# EAGLE design wheelBLE (EAGLE 8.1.0)
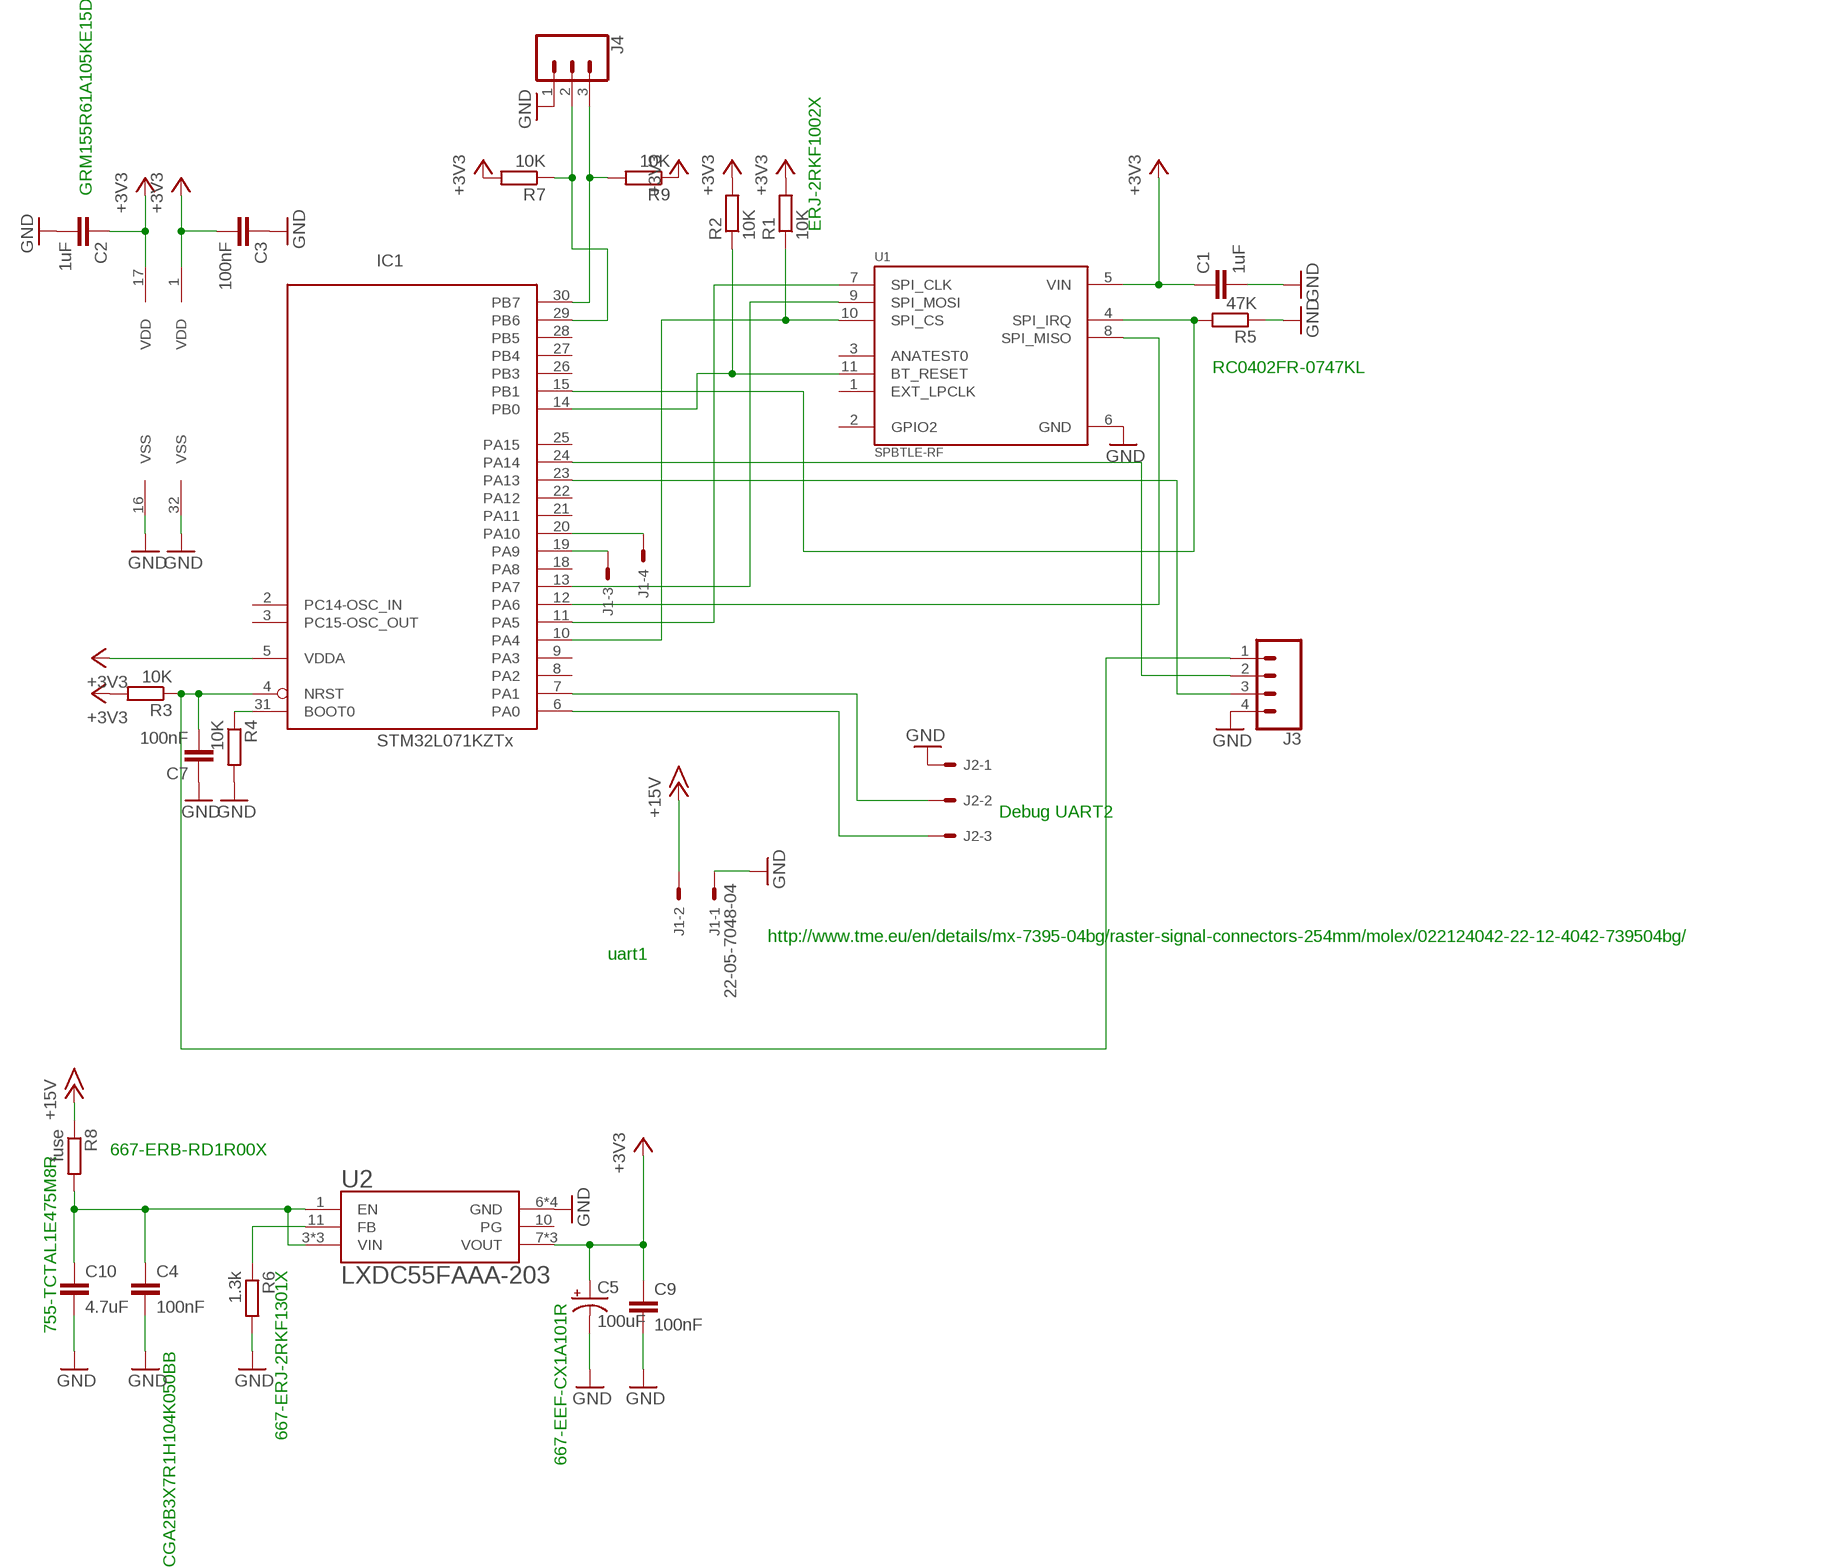
[diagram p0: schematic, sheet 1]

## Parts
C1  1uF  C-EUC0402  [C0402]
C2  1uF  C-EUC0402  [C0402]
C3  100nF  C-EUC0402  [C0402]
C4  100nF  C-EUC0402  [C0402]
C5  100uF  100UF-POLAR-EIA7343-10V-10%(TANT)  [EIA7343]
C7  100nF  C-EUC0402  [C0402]
C9  100nF  C-EUC0402  [C0402]
C10  4.7uF  4.7UF-1206-16V-(+80/-20%)  [1206]
IC1  STM32L071KZTx  STM32L051K8T  [LQFP32]
J1  22-05-7048-04  [7395-04]
J2  22-05-7038-03  [7395-03]
J3  CONN_04  [1X04]
J4  CONN_03SMD  [1X03-1MM-RA]
R1  10K  R-EU_R0402  [R0402]
R2  10K  R-EU_R0402  [R0402]
R3  10K  R-EU_R0402  [R0402]
R4  10K  R-EU_R0402  [R0402]
R5  47K  R-EU_R0402  [R0402]
R6  1.3k  R-EU_R0402  [R0402]
R7  10K  R-EU_R0402  [R0402]
R8  fuse  R-EU_R0402  [R0402]
R9  10K  R-EU_R0402  [R0402]
U1  SPBTLE-RF  [XCVR_SPBTLE-RF]
U2  LXDC55FAAA-203  [CONV_LXDC55FAAA-203]

## Nets
+3V3: C1.1 C2.1 C3.2 C5.A(+) C9.1 IC1.1(VDD) IC1.5(VDDA) IC1.17(VDD) R1.2 R2.2 R3.2 R7.2 R9.1 U1.5(VIN) U2.7(VOUT) U2.8(VOUT) U2.9(VOUT)
+15V: J1.2 R8.1
GND: C1.2 C2.2 C3.1 C4.2 C5.C(-) C7.1 C9.2 C10.2 IC1.16(VSS) IC1.32(VSS) J1.1 J2.1 J3.4 J4.1 R4.2 R5.1 R6.2 U1.6(GND) U2.6(GND) U2.12(GND) U2.13(GND) U2.14(GND)
N$1: IC1.10(PA4) R1.1 U1.10(SPI_CS)
N$2: IC1.14(PB0) R2.1 U1.11(BT_RESET)
N$3: C7.2 IC1.4(NRST) J3.1 R3.1
N$4: IC1.31(BOOT0) R4.1
N$5: IC1.11(PA5) U1.7(SPI_CLK)
N$6: IC1.12(PA6) U1.8(SPI_MISO)
N$7: IC1.13(PA7) U1.9(SPI_MOSI)
N$8: IC1.6(PA0) J2.3
N$9: IC1.19(PA9) J1.3
N$10: IC1.20(PA10) J1.4
N$11: IC1.15(PB1) R5.2 U1.4(SPI_IRQ)
N$12: IC1.7(PA1) J2.2
N$13: R6.1 U2.11(FB)
N$14: C4.1 C10.1 R8.2 U2.1(EN) U2.3(VIN) U2.4(VIN) U2.5(VIN)
N$15: IC1.23(PA13) J3.3
N$16: IC1.24(PA14) J3.2
N$17: IC1.30(PB7) J4.3 R9.2
N$18: IC1.29(PB6) J4.2 R7.1
Unconnected: IC1.2(PC14-OSC_IN) IC1.3(PC15-OSC_OUT) IC1.8(PA2) IC1.9(PA3) IC1.18(PA8) IC1.21(PA11) IC1.22(PA12) IC1.25(PA15) IC1.26(PB3) IC1.27(PB4) IC1.28(PB5) U1.1(EXT_LPCLK) U1.2(GPIO2) U1.3(ANATEST0) U2.10(PG)

## Notes on the sheet
- GRM155R61A105KE15D
- ERJ-2RKF1002X
- RC0402FR-0747KL
- Debug UART2
- http://www.tme.eu/en/details/mx-7395-04bg/raster-signal-connectors-254mm/molex/022124042-22-12-4042-739504bg/
- uart1
- 667-ERB-RD1R00X
- 667-EEF-CX1A101R
- 755-TCTAL1E475M8R
- CGA2B3X7R1H104K050BB
- 667-ERJ-2RKF1301X

## Library data of the parts
C1-C4 C7 C9 = rcl:C-EU: CAPACITOR, European symbol
C5 = SparkFun-Capacitors:100UF-POLAR: 100µF polarized capacitors A capacitor is a passive two-terminal electrical component used to store electrical energy temporarily in an electric field.; PROD_ID: CAP-07890
C10 = SparkFun-Capacitors:4.7UF: 4.7µF ceramic capacitors A capacitor is a passive two-terminal electrical component used to store electrical energy temporarily in an electric field.; PROD_ID: CAP-10300
IC1 = micro-stm_v2:STM32L051K*T: ARM 32-bit Cortex™-M0+ CPU 32 MHz maximum frequency 32 to 64 Kbytes of Flash memory 2 kbyte of Data EEPROM 8 kbytes of SRAM 27 GPIOs 1.8 to 3.6 V application supply
J1 = EP_molex_6410_7395:22-?-04: CONNECTOR wire to board 2.54 mm (.1 inch) pitch header
J2 = ep_molex_6410_7395-02:22-?-03: CONNECTOR wire to board 2.54 mm (.1 inch) pitch header
J3 = SparkFun-Connectors:CONN_04: Multi connection point. Often used as Generic Header-pin footprint for 0.1 inch spaced/style header connections On any of the 0.1 inch spaced packages, you can populate with these: Break Away Headers - Straight <https://www.sparkfun.com/products/116> (PRT-00116) Break Away Male Headers - Right Angle <https://www.sparkfun.com/products/553> (PRT-00553) Female Headers <https://www.sparkfun.com/products/115> (PRT-00115) Break Away Headers - Machine Pin <https://www.sparkfun.com/products/117> (PRT-00117) Break Away Female Headers - Swiss Machine Pin <https://www.sparkfun.com/products/743> (PRT-00743) For SCREWTERMINALS and SPRING TERMINALS visit here: Screw Terimnals on SparkFun.com <https://www.sparkfun.com/search/results?term=Screw+Terminals> (5mm/3.5mm/2.54mm spacing) This device is also useful as a general connection point to wire up your design to another part of your project. Our various solder wires solder well into these plated through hole pads. Hook-Up Wire - Assortment (Stranded, 22 AWG) <https://www.sparkfun.com/products/11375> (PRT-11375) Hook-Up Wire - Assortment (Solid Core, 22 AWG) <https://www.sparkfun.com/products/11367> (PRT-11367) View the entire wire category on our website here <https://www.sparkfun.com/categories/141> Special notes: Molex polarized connector foot print use with SKU : PRT-08231 with associated crimp pins and housings. 1MM SMD Version SKU: PRT-10208; PROD_ID: CONN-09696
J4 = SparkFun-Connectors:CONN_03: Multi connection point. Often used as Generic Header-pin footprint for 0.1 inch spaced/style header connections On any of the 0.1 inch spaced packages, you can populate with these: Break Away Headers - Straight <https://www.sparkfun.com/products/116> (PRT-00116) Break Away Male Headers - Right Angle <https://www.sparkfun.com/products/553> (PRT-00553) Female Headers <https://www.sparkfun.com/products/115> (PRT-00115) Break Away Headers - Machine Pin <https://www.sparkfun.com/products/117> (PRT-00117) Break Away Female Headers - Swiss Machine Pin <https://www.sparkfun.com/products/743> (PRT-00743) Stackable Header - 3 Pin (Female, 0.1") <https://www.sparkfun.com/products/13875> (PRT-13875) For SCREWTERMINALS and SPRING TERMINALS visit here: Screw Terimnals on SparkFun.com <https://www.sparkfun.com/search/results?term=Screw+Terminals> (5mm/3.5mm/2.54mm spacing) This device is also useful as a general connection point to wire up your design to another part of your project. Our various solder wires solder well into these plated through hole pads. Hook-Up Wire - Assortment (Stranded, 22 AWG) <https://www.sparkfun.com/products/11375> (PRT-11375) Hook-Up Wire - Assortment (Solid Core, 22 AWG) <https://www.sparkfun.com/products/11367> (PRT-11367) View the entire wire category on our website here <https://www.sparkfun.com/categories/141> Special notes: Molex polarized connector foot print use with SKU : PRT-08232 with associated crimp pins and housings.
R1-R9 = rcl:R-EU_: RESISTOR, European symbol
U1 = SPBTLE-RF:SPBTLE-RF: Very low power module for Bluetooth Smart v4.1; AVAILABILITY: Good; DESCRIPTION: Very low power module for Bluetooth Smart v4.1; MF: STMicroelectronics; MP: SPBTLE-RF; PACKAGE: None; PRICE: 7.77 USD
U2 = LXDC55FAAA-203:LXDC55FAAA-203: Conv DC-DC Quad Step Down 4V to 14V 14-Pin SMD T/R; AVAILABILITY: Good; DESCRIPTION: Conv DC-DC Quad Step Down 4V to 14V 14-Pin SMD T/R; MF: Murata; MP: LXDC55FAAA-203; PACKAGE: SMD-14 Murata; PRICE: 3.06 USD

## Board
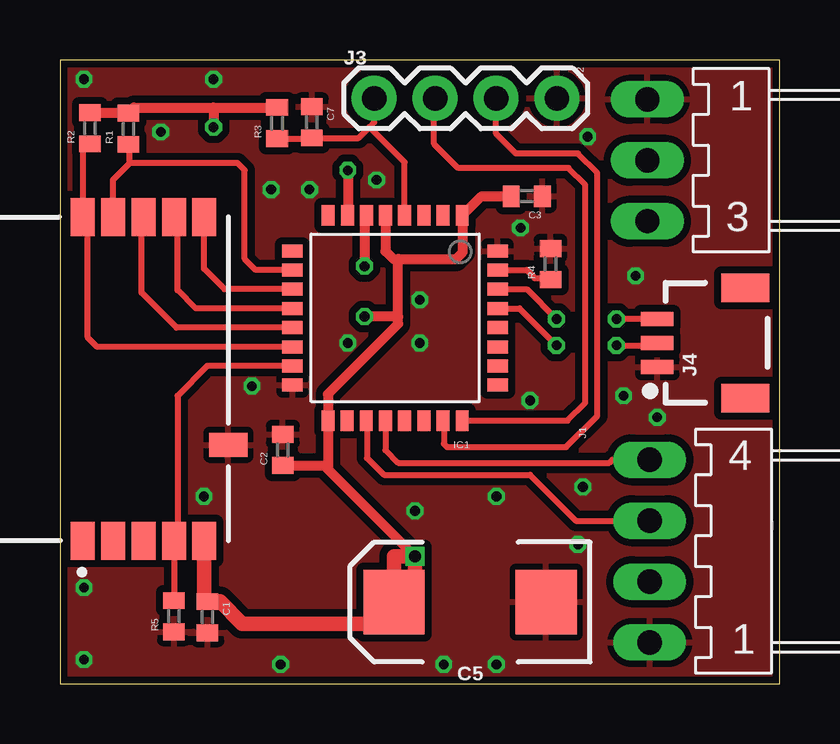
[diagram p1: board, top side]
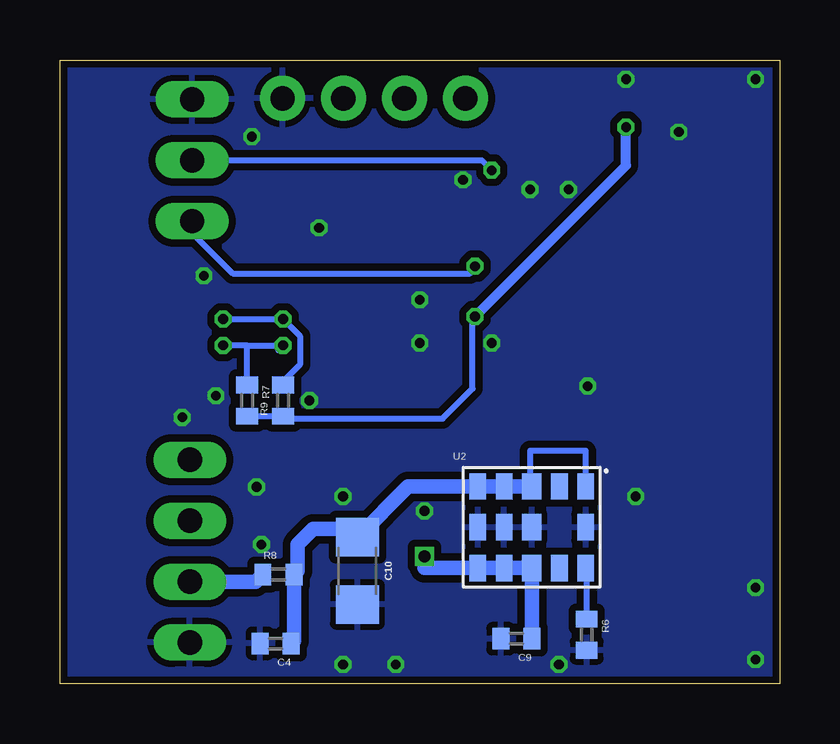
[diagram p2: board, bottom side, seen from below]

Size 30 x 26 mm. Coordinates in mm from the lower left corner, seen from the top.
Outline: 0,0 30,0 30,26 0,26 0,0
Copper layers (1*16): Top 0.035mm / dielectric 1.5mm / Bottom 0.035mm
Design rules "SeeedStudio_2layer_DRU_no_angle_20140221": minimum track width 6mil, minimum drill 12mil, track to track 6mil, track to pad 6mil, pad to pad 6mil, via to via 6mil, smd to smd 0mil, copper to edge 10mil, drill to drill 10mil, minimum pad ring 10mil, minimum via ring 6mil, stop-mask expansion 2mil, vias tented up to drill 100mil, thermal gap 10mil

### Footprints (pad centres in the part's own frame; a part is rotated, then mirrored left to right if it is on the bottom)
C0402 = smd 0.7 x 0.9: 1 -0.65,0; 2 0.65,0
EIA7343 = smd 2.55 x 2.7: A 3.17,0; C -3.17,0
1206 = smd 1.6 x 1.8: 1 -1.4,0; 2 1.4,0
LQFP32 = smd 0.54 x 0.85: 1 -2.8,-4.275; 2 -2,-4.275; 3 -1.2,-4.275; 4 -0.4,-4.275; 5 0.4,-4.275; 6 1.19,-4.275; 7 1.99,-4.275; 8 2.79,-4.275; 17 2.8,4.275; 18 2,4.275; 19 1.2,4.275; 20 0.4,4.275; 21 -0.4,4.275; 22 -1.2,4.275; 23 -2,4.275; 24 -2.8,4.275 | smd 0.85 x 0.54: 9 4.275,-2.8; 10 4.275,-2; 11 4.275,-1.2; 12 4.275,-0.4; 13 4.275,0.4; 14 4.275,1.2; 15 4.275,2; 16 4.275,2.8; 25 -4.275,2.8; 26 -4.275,2; 27 -4.275,1.2; 28 -4.275,0.4; 29 -4.275,-0.4; 30 -4.275,-1.2; 31 -4.275,-2; 32 -4.275,-2.8
7395-04 = drill 1.016 long: 1 3.81,0; 2 1.27,0; 3 -1.27,0; 4 -3.81,0
7395-03 = drill 1.016 long: 1 2.54,0; 2 0,0; 3 -2.54,0
1X04 = drill 1.016 pad 1.88: 1 0,0; 2 2.54,0; 3 5.08,0; 4 7.62,0
1X03-1MM-RA = smd 0.6 x 1.35: 1 -1,0; 2 0,0; 3 1,0 | smd 1.2 x 2: NC1 2.3,-3.675; NC2 -2.3,-3.675
R0402 = smd 0.7 x 0.9: 1 -0.65,0; 2 0.65,0
XCVR_SPBTLE-RF = smd 1.6 x 1: 1 -6.75,0.33; 2 -6.75,-0.94; 3 -6.75,-2.21; 4 -6.75,-3.48; 5 -6.75,-4.75; 7 6.75,-4.75; 8 6.75,-3.48; 9 6.75,-2.21; 10 6.75,-0.94; 11 6.75,0.33 | smd 1 x 1.6: 6 -2.75,-5.75
CONV_LXDC55FAAA-203 = smd 0.7 x 1.1: 1 2.25,1.7; 2 1.15,1.7; 4 -1.15,1.7; 5 -2.25,1.7; 6 -2.25,0; 7 -2.25,-1.7; 8 -1.15,-1.7; 10 1.15,-1.7; 11 2.25,-1.7; 12 2.25,0; 14 -1.15,0 | smd 0.8 x 1.1: 3 0,1.7; 9 0,-1.7; 13 0,0

### Placement (x,y rotation side)
C1  6.15,2.77 270 top
C2  9.29,9.74 90 top
C3  19.46,20.32 180 top
C4  21.01,1.67 180 bottom
C5  17.1,3.4 180 top
C7  10.5,23.4 270 top
C9  10.97,1.87 180 bottom
C10  17.6,4.7 270 bottom
IC1  13.97,15.24 180 top
J1  24.59,5.52 270 top
J2  24.49,21.82 90 top
J3  13.1,24.4 0 top
J4  24.9,14.2 90 top
R1  2.85,23.13 90 top
R2  1.25,23.15 90 top
R3  9.05,23.37 90 top
R4  20.45,17.49 90 top
R5  4.75,2.81 90 top
R6  8.04,2.04 270 bottom
R7  22.2,11.8 270 bottom
R8  20.89,4.55 0 bottom
R9  20.7,11.8 90 bottom
U1  1.27,12.7 90 top
U2  10.33,6.52 0 bottom

### Tracks (layer width: path | path; a pad name or v marks a point on that pad's centre or on a via)
+3V3  (via drill 0.4, 0.5)
  Top 0.254: 14.1,17.7 13.9,17.7 | IC1.1 16.8,19.48 | 1.27,23.78 R2.2 | 11.1,10.89 IC1.17 | R3.2 6.4,24.02 | v6.4,23.2 6.4,23.1
  Top 0.406: IC1.5 13.57,18.03 13.9,17.7 | 16.8,19.48 16.8,18 16.5,17.7 14.1,17.7 14.1,15.3 | 14.1,15.3 14.1,15 11.17,12.07 IC1.17 11.17,8.93 | 1.27,23.78 R1.2 3.09,24.02 R3.2 | IC1.1 17.57,20.32 C3.2 | C2.1 11.01,9.09 11.17,8.93 | 6.4,24.02 v6.4,23.2 | 14.1,15.3 v12.7,15.3 | 11.17,8.93 v14.8,5.3
  Top 0.61: U1.5 6.02,3.55 C1.1 6.68,3.42 7.6,2.5 14.8,2.5 v14.8,5.3 13.93,5.3 C5.A
  Bottom 0.254: v12.7,15.3 12.8,15.2 12.8,12.3 14.05,11.05 20.6,11.05 R9.1 R7.2
  Bottom 0.406: v12.7,15.3 6.4,21.6 v6.4,23.2
  Bottom 0.61: v14.8,5.3 14.8,4.82 U2.7 U2.8 U2.9 C9.1
+15V
  Bottom 0.61: R8.1 21.84,4.25 J1.2
GND  (via drill 0.4)
  other vias: 1,1 1,4 9.2,0.8 16,0.8 18.2,0.8 18.2,7.8 21.8,8.2 21.6,5.8 19.6,11.8 24,17 22,22.8 13.2,21 8.8,20.6 10.4,20.6 4.2,23 1,25.2 6.4,25.2 12,14.2 15,14.2 15,16 24.9,11.1 23.5,12 14.8,7.2 6,7.8 8,12.4 19.2,19
  pour Top (isolate 0.305): 0,26 0,0 30,0 30,26
  pour Bottom (isolate 0.305): 0,26 0,0 30,0 30,26
N$1
  Top 0.254: U1.10 2.21,21.01 2.9,21.7 | 2.9,21.7 2.9,22.43 R1.1 | IC1.10 8.16,17.24 7.7,17.7 7.7,21.4 7.4,21.7 2.9,21.7
N$2
  Top 0.254: U1.11 0.94,22.19 R2.1 | IC1.14 1.56,14.04 1.14,14.46 1.14,19.65 | 1.14,19.65 1.14,19.8 1.14,19.65
  Top 0.406: U1.11 1.14,19.65
N$3
  Top 0.254: 13,24.5 J3.1 13.1,23.4 12.9,23.2 | R3.1 10.47,22.72 C7.2 12.45,22.75 12.9,23.2 | IC1.4 14.37,21.73 12.9,23.2
N$4
  Top 0.254: IC1.31 19.46,17.24 19.8,16.9 20.39,16.9 R4.1
N$5
  Top 0.254: IC1.11 6.86,16.44 6,17.3 6,19.43 U1.7
N$6
  Top 0.254: IC1.12 5.66,15.64 4.9,16.4 4.9,19.3 U1.8
N$7
  Top 0.254: IC1.13 4.86,14.84 3.4,16.3 3.4,19.37 U1.9
N$8  (via drill 0.4)
  Top 0.254: 12.7,19.43 IC1.6
  Top 0.406: 12.7,19.43 v12.7,17.4
  Bottom 0.254: v12.7,17.4 12.6,17.4 12.9,17.1 22.8,17.1 24.49,18.79 J2.3
N$9
  Top 0.254: IC1.19 12.8,10.94 12.8,9.4 13.5,8.7 19.6,8.7 21.51,6.79 J1.3
N$10
  Top 0.254: IC1.20 13.57,9.73 14.1,9.2 22.9,9.2 23.03,9.33 J1.4
N$11
  Top 0.254: R5.2 U1.4 4.9,6.1 4.9,12 6.14,13.24 IC1.15
N$12  (via drill 0.4)
  Top 0.254: 12,19.54 IC1.7
  Top 0.406: v12,21.4 12,19.54
  Bottom 0.254: J2.2 12.42,21.82 v12,21.4
N$13
  Bottom 0.254: R6.1 8.04,4.78 U2.11
N$14
  Bottom 0.254: 17.95,6.45 C10.1 | U2.1 8.08,9.7 10.4,9.7 10.4,8.22 U2.3
  Bottom 0.61: 17.95,6.45 19.45,6.45 20.1,5.8 20.1,4.69 R8.2 20.24,1.79 C4.1 | C10.1 15.48,8.22 U2.5 U2.4 U2.3
N$15
  Top 0.254: IC1.23 16,10.94 16,10 16.14,9.86 21.1,9.86 22.4,11.16 22.4,21.3 21.6,22.1 19,22.1 18.18,22.92 J3.3
N$16
  Top 0.254: IC1.24 21.16,10.96 21.9,11.7 21.9,20.8 21.2,21.5 16.6,21.5 15.6,22.5 15.6,24.36 J3.2
N$17  (via drill 0.4)
  Top 0.254: IC1.30 19.46,16.44 v20.7,15.2 | J4.3 v23.2,15.2
  Bottom 0.254: v23.2,15.2 v20.7,15.2 20,14.5 20,13.3 20.7,12.6 R9.2
N$18  (via drill 0.4)
  Top 0.254: IC1.29 19.16,15.64 v20.7,14.1 | v23.2,14.1 25,14.1 J4.2
  Bottom 0.254: 22.2,14.1 v20.7,14.1 20.9,13.9 | 22.2,14.1 v23.2,14.1 | R7.1 22.2,14.1